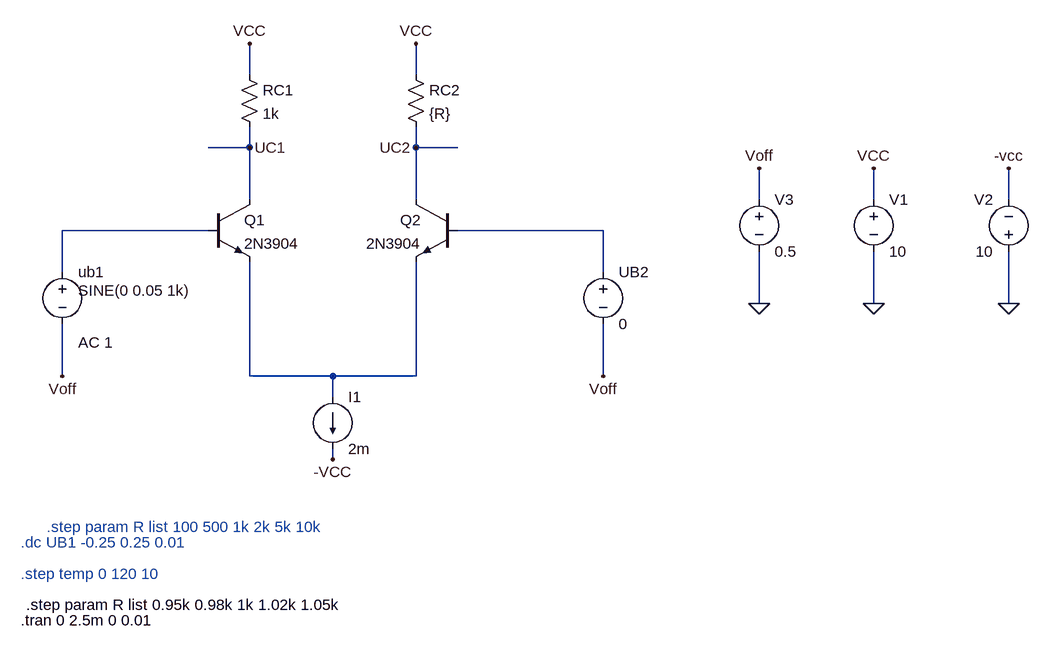
[diagram p0: schematic meros 4o D).asc]
meros 4o D).asc, the LTspice schematic file:
Version 4
SHEET 1 1336 792
WIRE 128 -64 128 -112
WIRE 384 -64 384 -112
WIRE 128 48 128 16
WIRE 128 48 64 48
WIRE 384 48 384 16
WIRE 448 48 384 48
WIRE 128 128 128 48
WIRE 384 128 384 48
WIRE 912 128 912 80
WIRE 1088 128 1088 80
WIRE 1296 128 1296 80
WIRE 64 176 -160 176
WIRE 672 176 448 176
WIRE -160 240 -160 176
WIRE 672 240 672 176
WIRE 912 288 912 208
WIRE 1088 288 1088 208
WIRE 1296 288 1296 208
WIRE -160 400 -160 320
WIRE 128 400 128 224
WIRE 256 400 128 400
WIRE 384 400 384 224
WIRE 384 400 256 400
WIRE 672 400 672 320
WIRE 256 432 256 400
WIRE 256 528 256 512
FLAG 1088 288 0
FLAG 1088 80 VCC
FLAG 384 -112 VCC
FLAG 128 -112 VCC
FLAG 128 48 UC1
FLAG 384 48 UC2
FLAG 256 528 -VCC
FLAG 1296 80 -vcc
FLAG 1296 288 0
FLAG 912 288 0
FLAG 912 80 Voff
FLAG -160 400 Voff
FLAG 672 400 Voff
SYMBOL npn 64 128 R0
SYMATTR InstName Q1
SYMATTR Value 2N3904
SYMBOL npn 448 128 M0
SYMATTR InstName Q2
SYMATTR Value 2N3904
SYMBOL res 368 -80 R0
SYMATTR InstName RC2
SYMATTR Value {R}
SYMBOL res 112 -80 R0
SYMATTR InstName RC1
SYMATTR Value 1k
SYMBOL voltage 672 224 R0
SYMATTR InstName UB2
SYMATTR Value 0
SYMBOL voltage 1088 112 R0
SYMATTR InstName V1
SYMATTR Value 10
SYMBOL current 256 432 R0
SYMATTR InstName I1
SYMATTR Value 2m
SYMBOL voltage -160 224 R0
WINDOW 123 24 124 Left 2
WINDOW 39 0 0 Left 0
WINDOW 3 24 44 Left 2
SYMATTR Value2 AC 1
SYMATTR Value SINE(0 0.05 1k)
SYMATTR InstName ub1
SYMBOL voltage 1296 224 R180
WINDOW 0 24 96 Left 2
WINDOW 3 24 16 Left 2
SYMATTR InstName V2
SYMATTR Value 10
SYMBOL voltage 912 112 R0
WINDOW 123 0 0 Left 0
WINDOW 39 0 0 Left 0
SYMATTR InstName V3
SYMATTR Value 0.5
TEXT -184 632 Left 2 ;.step param R list 100 500 1k 2k 5k 10k
TEXT -224 656 Left 2 ;.dc UB1 -0.25 0.25 0.01
TEXT -224 704 Left 2 ;.step temp 0 120 10
TEXT -216 752 Left 2 !.step param R list 0.95k 0.98k 1k 1.02k 1.05k
TEXT -224 776 Left 2 !.tran 0 2.5m 0 0.01

The netlist it stands for:
* meros 4o D).asc
Q1 UC1 N001 N003 0 2N3904
Q2 UC2 N002 N003 0 2N3904
RC2 VCC UC2 {R}
RC1 VCC UC1 1k
V§UB2 N002 Voff 0
V1 VCC 0 10
I1 N003 -VCC 2m
V§ub1 N001 Voff SINE(0 0.05 1k) AC 1
V2 0 -VCC 10
V3 Voff 0 0.5
.model NPN NPN
.model PNP PNP
.lib standard.bjt
* .step param R list 100 500 1k 2k 5k 10k
* .dc UB1 -0.25 0.25 0.01
* .step temp 0 120 10
.step param R list 0.95k 0.98k 1k 1.02k 1.05k
.tran 0 2.5m 0 0.01
.backanno
.end